# Altium schematic sheet TopLevel.SchDoc: Top Sheet V0
size Letter; Organization: PulseOut COVID; Address1: By: C. Miller; Address2: By. N. Petrunyak; Address3: pulseoutcovid.com; DocumentNumber: 1; Revision: 0; SheetNumber: 1; SheetTotal: 5
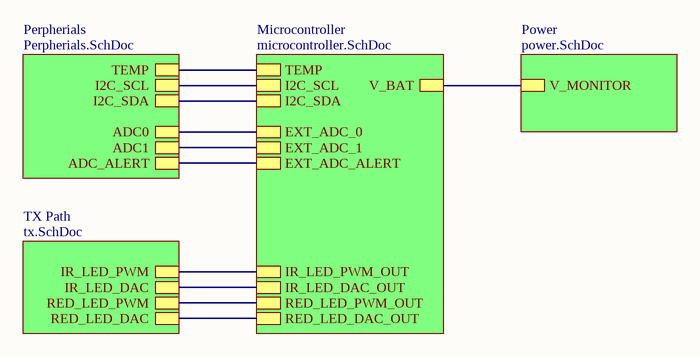
[diagram p0: TopLevel.SchDoc]

## Sub-sheets
Microcontroller = microcontroller.SchDoc: TEMP, I2C_SCL, IR_LED_PWM_OUT, RED_LED_PWM_OUT, I2C_SDA, V_BAT, EXT_ADC_0, EXT_ADC_1, EXT_ADC_ALERT, IR_LED_DAC_OUT, RED_LED_DAC_OUT
Perpherials = Perpherials.SchDoc: TEMP, I2C_SCL, I2C_SDA, ADC0, ADC1, ADC_ALERT
Power = power.SchDoc: V_MONITOR
TX Path = tx.SchDoc: IR_LED_DAC, RED_LED_DAC, IR_LED_PWM, RED_LED_PWM

## Nets
(unnamed): sheet Microcontroller/TEMP, sheet Perpherials/TEMP
(unnamed): sheet Microcontroller/I2C_SCL, sheet Perpherials/I2C_SCL
(unnamed): sheet Microcontroller/IR_LED_PWM_OUT, sheet TX Path/IR_LED_PWM
(unnamed): sheet Microcontroller/RED_LED_PWM_OUT, sheet TX Path/RED_LED_PWM
(unnamed): sheet Microcontroller/I2C_SDA, sheet Perpherials/I2C_SDA
(unnamed): sheet Microcontroller/V_BAT, sheet Power/V_MONITOR
(unnamed): sheet Microcontroller/EXT_ADC_0, sheet Perpherials/ADC0
(unnamed): sheet Microcontroller/EXT_ADC_1, sheet Perpherials/ADC1
(unnamed): sheet Microcontroller/EXT_ADC_ALERT, sheet Perpherials/ADC_ALERT
(unnamed): sheet Microcontroller/IR_LED_DAC_OUT, sheet TX Path/IR_LED_DAC
(unnamed): sheet Microcontroller/RED_LED_DAC_OUT, sheet TX Path/RED_LED_DAC

## Notes on the sheet
- Title
- Size:
- Date:
- Letter
- Number:
- Time:
- Revision:
- Sheet
- of
- File: